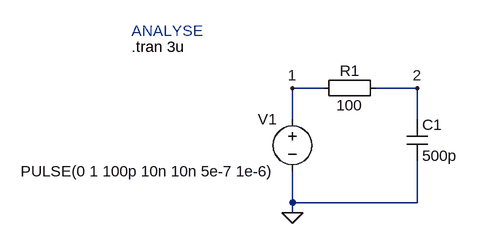
[diagram p0: schematic kap433_reisch.asc]
kap433_reisch.asc, the LTspice schematic file:
Version 4.1
SHEET 1 880 680
WIRE 80 80 32 80
WIRE 224 80 160 80
WIRE 32 128 32 80
WIRE 224 128 224 80
WIRE 32 256 32 208
WIRE 224 256 224 192
WIRE 224 256 32 256
WIRE 32 272 32 256
FLAG 32 272 0
FLAG 32 80 1
FLAG 224 80 2
SYMBOL cap 208 128 R0
SYMATTR InstName C1
SYMATTR Value 500p
SYMBOL EuropeanResistor 176 64 R90
WINDOW 0 5 56 VBottom 2
WINDOW 3 27 56 VTop 2
SYMATTR InstName R1
SYMATTR Value 100
SYMBOL voltage 32 112 M0
WINDOW 123 0 0 Left 0
WINDOW 39 0 0 Left 0
SYMATTR InstName V1
SYMATTR Value PULSE(0 1 100p 10n 10n 5e-7 1e-6)
TEXT -216 16 Left 2 !.tran 3u
TEXT -216 -8 Left 2 ;ANALYSE

The netlist it stands for:
* kap433_reisch.asc
C1 2 0 500p
R1 2 1 100
V1 1 0 PULSE(0 1 100p 10n 10n 5e-7 1e-6)
.tran 3u
* ANALYSE
.backanno
.end

* Results of the author's LTspice run, read from the files saved beside the schematic
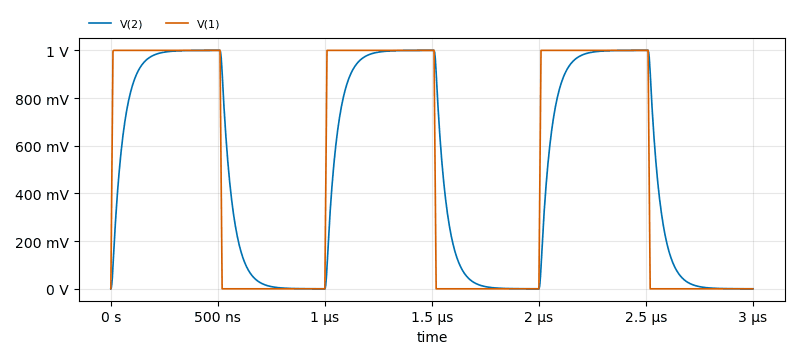
[diagram p1: Transient Analysis of kap433_reisch.asc, plotted from the saved traces]
* Transient Analysis, 1 run:
*   V(2): min 0 V, max 1 V, average 510 mV, rms 678.1 mV, last 61.35 µV
*   V(1): min 0 V, max 1 V, average 510 mV, rms 712 mV, last 0 V